# EAGLE schematic LevelSensor (EAGLE 9.5.2)
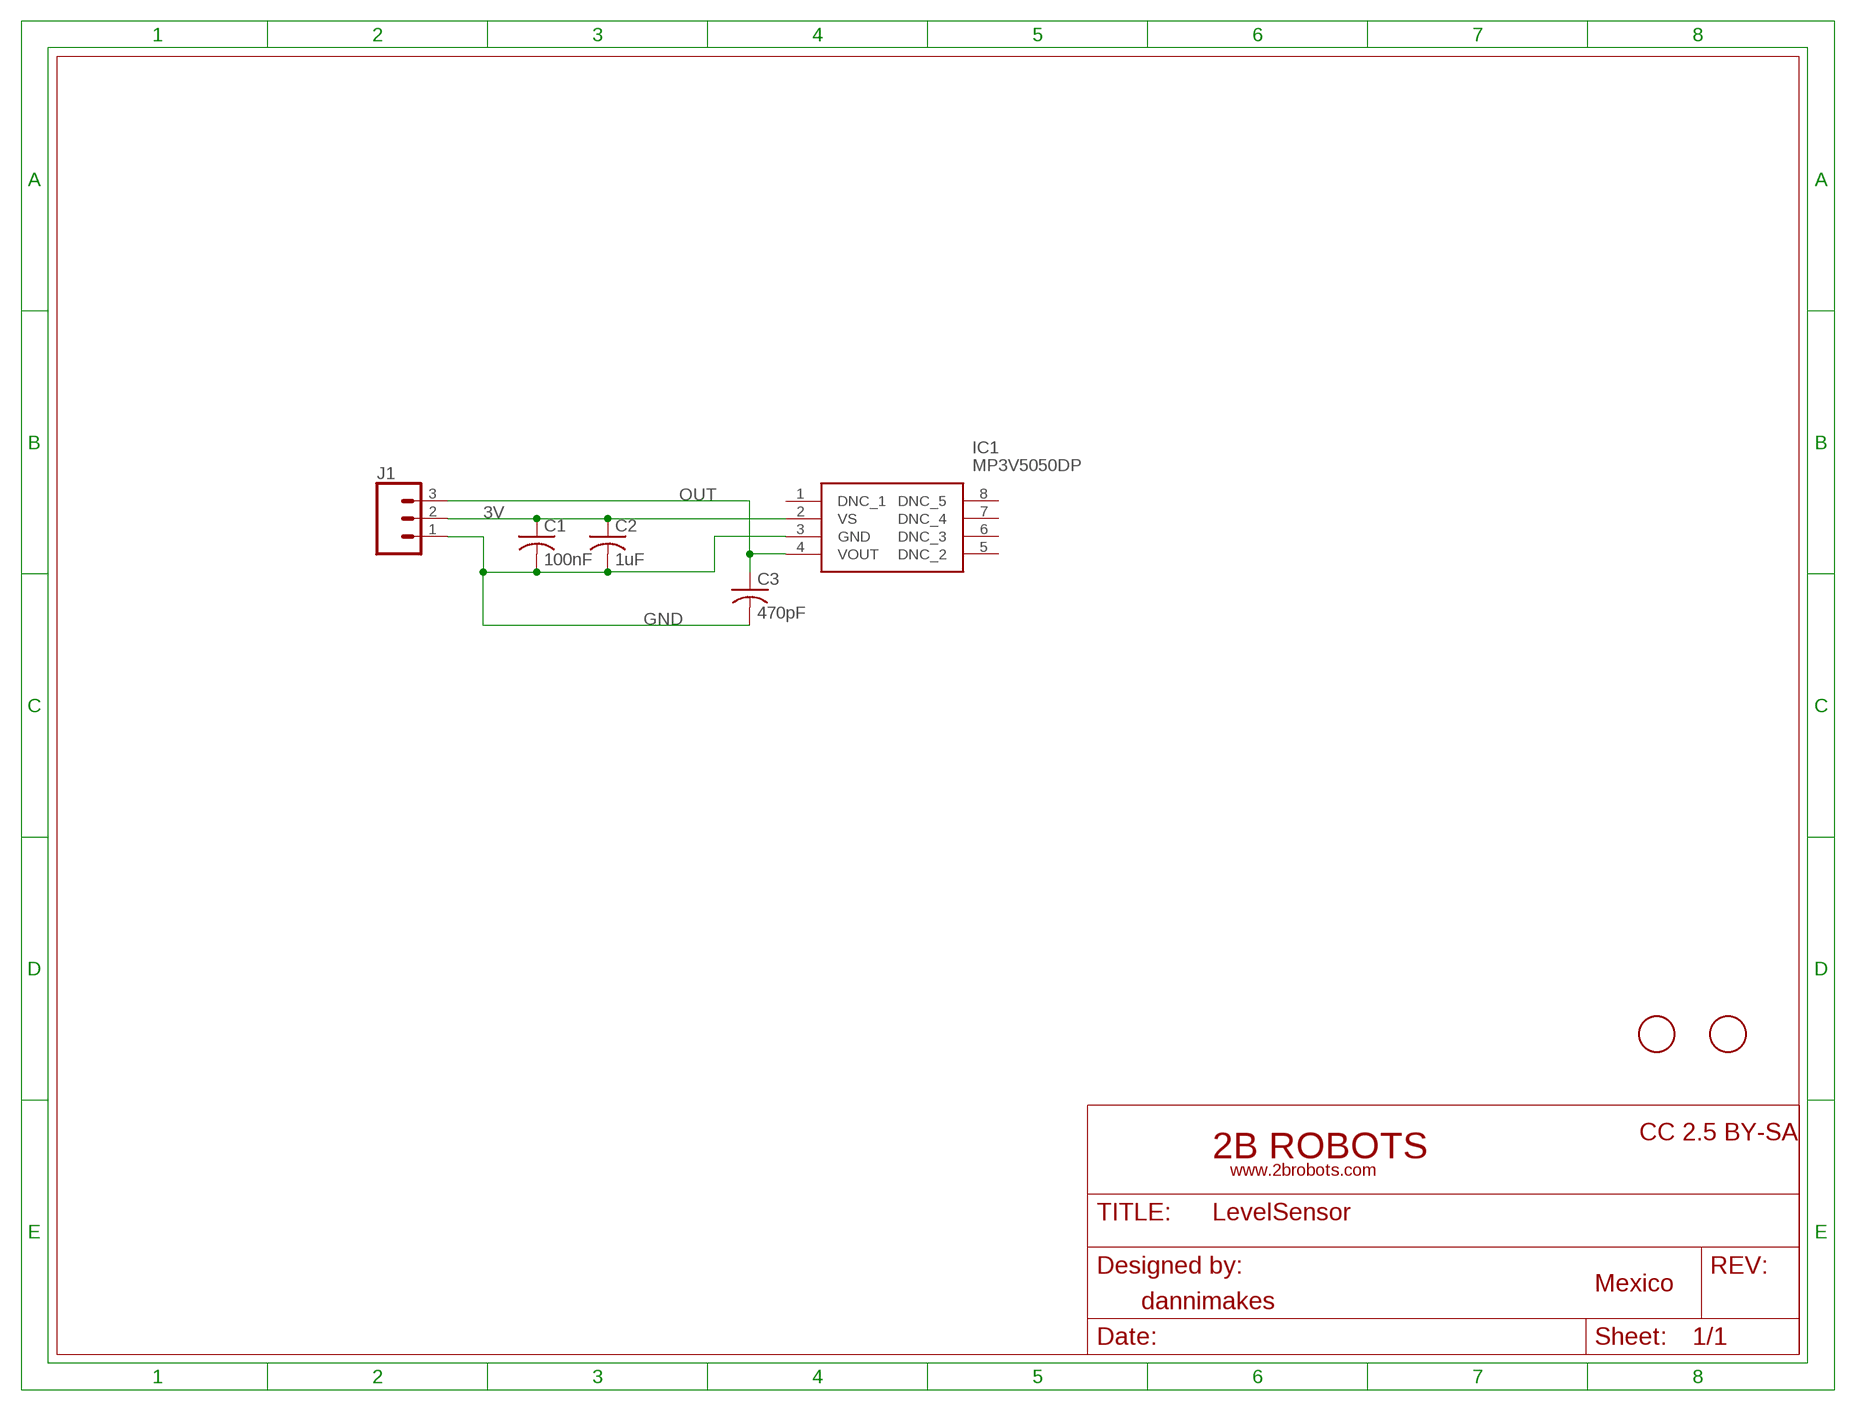
[diagram p0: schematic, sheet 1]

## Parts
C1  100nF  C-USC0603K  [C0603K]
C2  1uF  C-USC0603K  [C0603K]
C3  470pF  C-USC0805K  [C0805K]
IC1  MP3V5050DP  [SOP254P1753X991-8N]
J1  CONN_03-SCREW-5MM  [SCREWTERMINAL-5MM-3]
U$2  FIDUCIAL  [FIDUCIAL_1MM]
U$3  FIDUCIAL  [FIDUCIAL_1MM]

## Nets
3V: C1.1 C2.1 IC1.2(VS) J1.2
GND: C1.2 C2.2 C3.2 IC1.3(GND) J1.1
OUT: C3.1 IC1.4(VOUT) J1.3
Unconnected: IC1.1(DNC_1) IC1.5(DNC_2) IC1.6(DNC_3) IC1.7(DNC_4) IC1.8(DNC_5)

## Library data of the parts
C1-C3 = adafruit:C-US: CAPACITOR, American symbol
IC1 = SamacSys_Parts:MP3V5050DP: NXP - MP3V5050DP - PRESSURE SENSOR, 0-50KPA, SOP-8 Source: Datasheet <https://componentsearchengine.com/Datasheets/1/MP3V5050DP.pdf>; DESCRIPTION: NXP - MP3V5050DP - PRESSURE SENSOR, 0-50KPA, SOP-8; HEIGHT: 9.906mm; MANUFACTURER_NAME: Nexperia; MANUFACTURER_PART_NUMBER: MP3V5050DP; MOUSER_PART_NUMBER: 841-MP3V5050DP; MOUSER_PRICE-STOCK: https://www.mouser.com/Search/Refine.aspx?Keyword=841-MP3V5050DP
J1 = SparkFun-Connectors:CONN_03: Multi connection point. Often used as Generic Header-pin footprint for 0.1 inch spaced/style header connections On any of the 0.1 inch spaced packages, you can populate with these: Break Away Headers - Straight <https://www.sparkfun.com/products/116> (PRT-00116) Break Away Male Headers - Right Angle <https://www.sparkfun.com/products/553> (PRT-00553) Female Headers <https://www.sparkfun.com/products/115> (PRT-00115) Break Away Headers - Machine Pin <https://www.sparkfun.com/products/117> (PRT-00117) Break Away Female Headers - Swiss Machine Pin <https://www.sparkfun.com/products/743> (PRT-00743) Stackable Header - 3 Pin (Female, 0.1") <https://www.sparkfun.com/products/13875> (PRT-13875) For SCREWTERMINALS and SPRING TERMINALS visit here: Screw Terimnals on SparkFun.com <https://www.sparkfun.com/search/results?term=Screw+Terminals> (5mm/3.5mm/2.54mm spacing) This device is also useful as a general connection point to wire up your design to another part of your project. Our various solder wires solder well into these plated through hole pads. Hook-Up Wire - Assortment (Stranded, 22 AWG) <https://www.sparkfun.com/products/11375> (PRT-11375) Hook-Up Wire - Assortment (Solid Core, 22 AWG) <https://www.sparkfun.com/products/11367> (PRT-11367) View the entire wire category on our website here <https://www.sparkfun.com/categories/141> Special notes: Molex polarized connector foot print use with SKU : PRT-08232 with associated crimp pins and housings.; PROD_ID: CONN-10134; SF_SKU: PRT-08433
U$2 U$3 = adafruit:FIDUCIAL: For use by pick and place machines to calibrate the vision/machine, 1mm By microbuilder.eu